# Altium schematic sheet PWM schematic.SchDoc
size A4; SheetNumber: 1; SheetTotal: 1; SPICEModelCacheMFJXASHD: <root> / <DocumentId>MFJXASHD</DocumentId> / <CacheFrame Number="0"> / <Model Name="xtal" Kind="CKT"> / <Text>*Generic type:crystal pkg:HC33/51 / .SUBCKT XTAL 1 2 PARAMS: FREQ=1Meg RS=750 C=13pf Q=1000 / LX 1 3 {((Q*RS)/(6.2831852*FREQ))} IC=0.5M / CX 3 4 {(1/(Q*6.2831852*FREQ*RS))} / C0 1 2 {C} / RS 4 2 {RS} / .ENDS XTAL</Text> / </Model> / <Model Name="4040" Kind="MDL"> / <Text>*12-bit Binary Counter - type:digital pkg:DIP16 [DVDD=16;DGND=8;](10,11,9,7,6,5,3,2,4,13,12,14,15,1) / .MODEL 4040 xsimcode(file="{MODEL_PATH}\Fairchild\4040.txt" func=4040 {mntymx})</Text> / </Model> / <Model Name="led1" Kind="MDL"> / <Text>*Typ RED GaAs LED: Vf=1.7V Vr=4V If=40mA trr=3uS / *LED Pinout: 1=A, 2=K / .MODEL LED1 D (IS=93.2P RS=42M N=3.73 BV=4 IBV=10U / + CJO=2.97P VJ=.75 M=.333 TT=4.32U)</Text> / </Model> / </CacheFrame> / </root>
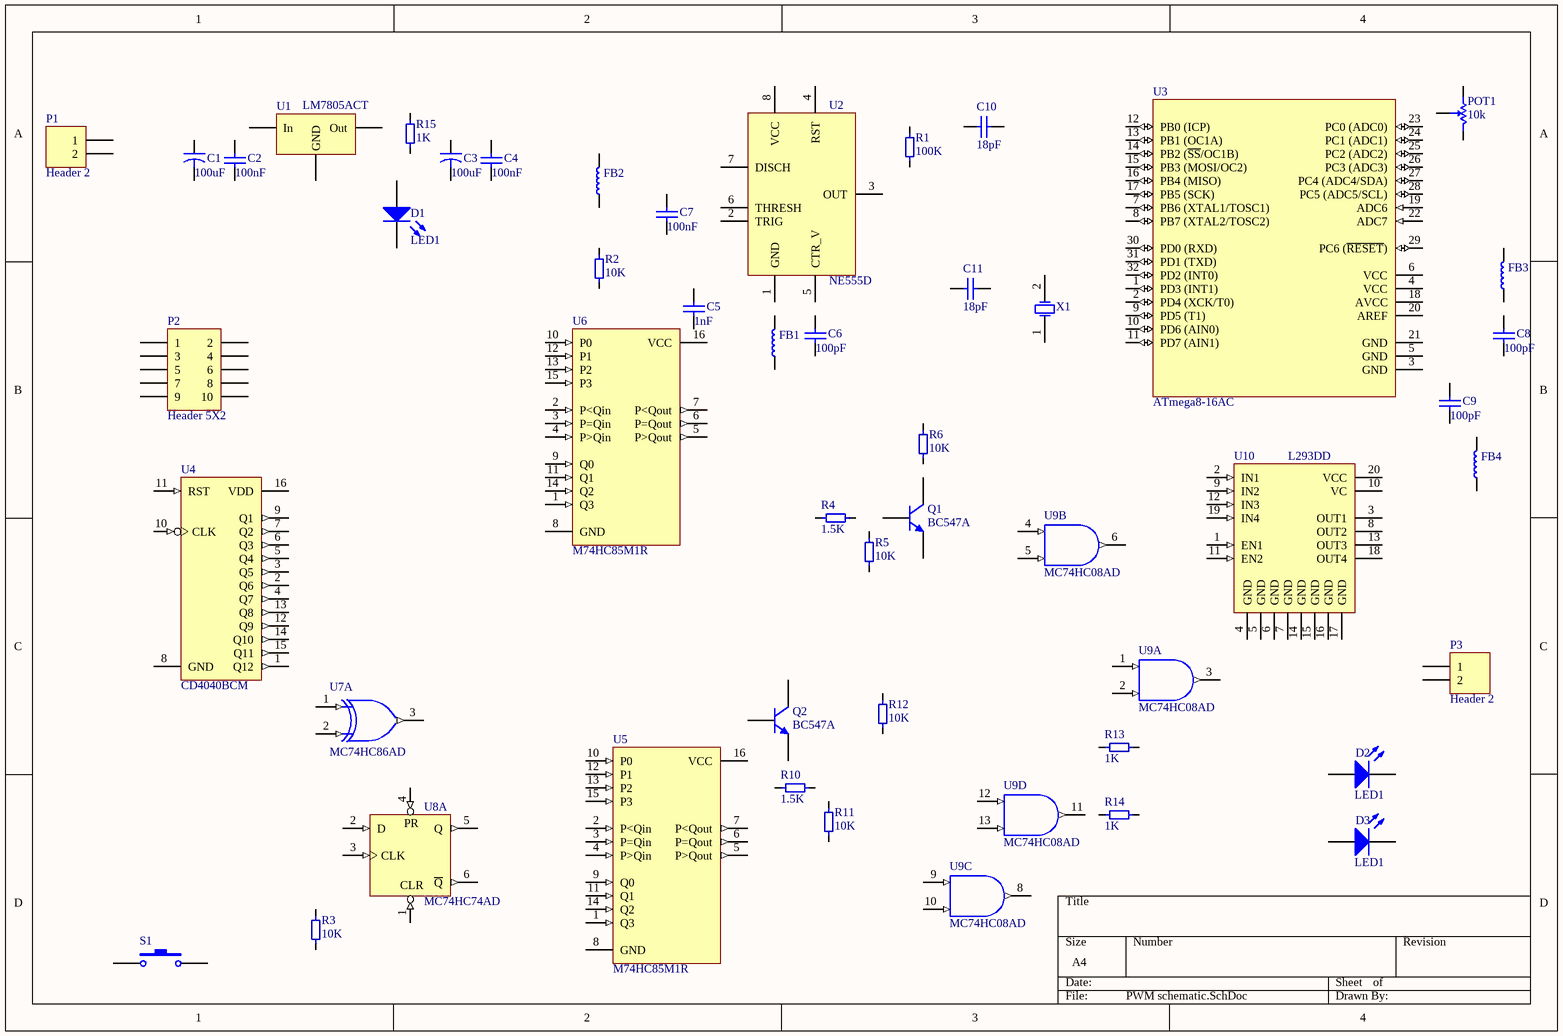
[diagram p0: PWM schematic.SchDoc]

## Parts
C1  value 100uF  [CAP_POL]  (hidden comment: Cap2)
C2  value 100nF  [SMD_805_CAP]  (hidden comment: Cap)
C3  value 100uF  [CAP_POL]  (hidden comment: Cap2)
C4  value 100nF  [SMD_805_CAP]  (hidden comment: Cap)
C5  value 1nF  [SMD_805_CAP]  (hidden comment: Cap)
C6  value 100pF  [SMD_805_CAP]  (hidden comment: Cap)
C7  value 100nF  [SMD_805_CAP]  (hidden comment: Cap)
C8  value 100pF  [SMD_805_CAP]  (hidden comment: Cap)
C9  value 100pF  [SMD_805_CAP]  (hidden comment: Cap)
C10  value 18pF  [SMD_805_CAP]  (hidden comment: Cap)
C11  value 18pF  [SMD_805_CAP]  (hidden comment: Cap)
D1  LED1  [SMD_1206_LED]
D2  LED1  [SMD_1206_LED]
D3  LED1  [SMD_1206_LED]
FB1  Ferrit Bead  [SMD_805_RES]  (value not drawn)
FB2  Ferrit Bead  [SMD_805_RES]  (value not drawn)
FB3  Ferrit Bead  [SMD_805_RES]  (value not drawn)
FB4  Ferrit Bead  [SMD_805_RES]  (value not drawn)
P1  Header 2  [ADAP_JACK2]
P2  Header 5X2  [BOX2x5_3D]
P3  Header 2  [PHOENIX_3]
POT1  10k  [Potentiometer]
Q1  BC547A  [2N3906 SOT23]
Q2  BC547A  [2N3906 SOT23]
R1  Resistor SMD  [SMD_805_RES]  (value not drawn)
R2  Resistor SMD  [SMD_805_RES]  (value not drawn)
R3  Resistor SMD  [SMD_805_RES]  (value not drawn)
R4  Resistor SMD  [SMD_805_RES]  (value not drawn)
R5  Resistor SMD  [SMD_805_RES]  (value not drawn)
R6  Resistor SMD  [SMD_805_RES]  (value not drawn)
R10  Resistor SMD  [SMD_805_RES]  (value not drawn)
R11  Resistor SMD  [SMD_805_RES]  (value not drawn)
R12  Resistor SMD  [SMD_805_RES]  (value not drawn)
R13  Resistor SMD  [SMD_805_RES]  (value not drawn)
R14  Resistor SMD  [SMD_805_RES]  (value not drawn)
R15  Resistor SMD  [SMD_805_RES]  (value not drawn)
S1  SW-PB  [PB_KEY]  (value not drawn)
U1  LM7805ACT  [TO220-3]
U2  NE555D  [SOIC-8]
U3  ATmega8-16AC  [32A_N]
U4  CD4040BCM  [M16A_N]
U5  M74HC85M1R  [SO16_N]
U6  M74HC85M1R  [SO16_N]
U7  MC74HC86AD  [751A-03_N]  (part A of 4)
U8  MC74HC74AD  [751A-03_N]  (part A of 2)
U9  MC74HC08AD  [751A-02_N]  (parts A,B,C,D of 4)
U10  L293DD  [SO20_N]
X1  XTAL  [Xtal]  (value not drawn)

## Nets
GND: U7.7(GND) U8.7(GND) U9.7(GND)
VDD: U7.14(VDD) U8.14(VDD) U9.14(VDD)

Not connected (* = marked no-connect by the designer): C1 1 2; C2 1 2; C3 1 2; C4 1 2; C5 1 2; C6 1 2; C7 1 2; C8 1 2; C9 1 2; C10 1 2; C11 1 2; D1 1(A) 2(K); D2 1(A) 2(K); D3 1(A) 2(K); FB1 1 2; FB2 1 2; FB3 1 2; FB4 1 2; P1 1 2; P2 1 2 3 4 5 6 7 8 9 10; P3 1 2; POT1 1(CCW) 2(CW) 3(SetPoint); Q1 1(C) 2(B) 3(E); Q2 1(C) 2(B) 3(E); R1 1 2; R2 1 2; R3 1 2; R4 1 2; R5 1 2; R6 1 2; R10 1 2; R11 1 2; R12 1 2; R13 1 2; R14 1 2; R15 1 2; S1 1 2; U1 1(In) 2(GND) 3(Out); U2 1(GND) 2(TRIG) 3(OUT) 4(RST) 5(CTR_V) 6(THRESH) 7(DISCH) 8(VCC); U3 1(PD3_(INT1)) 2(PD4_(XCK/T0)) 3(GND) 4(VCC) 5(GND) 6(VCC) 7(PB6_(XTAL1/TOSC1)) 8(PB7_(XTAL2/TOSC2)) 9(PD5_(T1)) 10(PD6_(AIN0)) 11(PD7_(AIN1)) 12(PB0_(ICP)) 13(PB1_(OC1A)) 14(PB2_(~{SS}/OC1B)) 15(PB3_(MOSI/OC2)) 16(PB4_(MISO)) 17(PB5_(SCK)) 18(AVCC) 19(ADC6) 20(AREF) 21(GND) 22(ADC7) 23(PC0_(ADC0)) 24(PC1_(ADC1)) 25(PC2_(ADC2)) 26(PC3_(ADC3)) 27(PC4_(ADC4/SDA)) 28(PC5_(ADC5/SCL)) 29(PC6_(~{RESET})) 30(PD0_(RXD)) 31(PD1_(TXD)) 32(PD2_(INT0)); U4 1(Q12) 2(Q6) 3(Q5) 4(Q7) 5(Q4) 6(Q3) 7(Q2) 8(GND) 9(Q1) 10(CLK) 11(RST) 12(Q9) 13(Q8) 14(Q10) 15(Q11) 16(VDD); U5 1(Q3) 2(P<Qin) 3(P=Qin) 4(P>Qin) 5(P>Qout) 6(P=Qout) 7(P<Qout) 8(GND) 9(Q0) 10(P0) 11(Q1) 12(P1) 13(P2) 14(Q2) 15(P3) 16(VCC); U6 1(Q3) 2(P<Qin) 3(P=Qin) 4(P>Qin) 5(P>Qout) 6(P=Qout) 7(P<Qout) 8(GND) 9(Q0) 10(P0) 11(Q1) 12(P1) 13(P2) 14(Q2) 15(P3) 16(VCC); U7 1(A) 2(B) 3(Y); U8 1(CLR) 2(D) 3(CLK) 4(PR) 5(Q) 6(~{Q}); U9 1(A) 2(B) 3(Y) 4(A) 5(B) 6(Y) 8(Y) 9(A) 10(B) 11(Y) 12(A) 13(B); U10 1(EN1) 2(IN1) 3(OUT1) 4(GND) 5(GND) 6(GND) 7(GND) 8(OUT2) 9(IN2) 10(VC) 11(EN2) 12(IN3) 13(OUT3) 14(GND) 15(GND) 16(GND) 17(GND) 18(OUT4) 19(IN4) 20(VCC); X1 1(OSC1) 2(OSC2)

## Notes on the sheet
- (in symbol Resistor SMD) 100K; 10K; 1.5K; 1K

## Library data of the parts
C1 C3 = Cap2: Capacitor; Published: 23-Sep-2002; PackageReference: CAPR5-4X5; Publisher: Altium Limited
C2 C4-C11 = Cap: Capacitor; Published: 8-Jun-2000; LatestRevisionDate: 17-Jul-2002; LatestRevisionNote: Re-released for DXP Platform.; PackageReference: RAD-0.3; Publisher: Altium Limited
D1-D3 = LED1: Typical RED GaAs LED; Published: 8-Jun-2000; LatestRevisionDate: 08-Jul-2005; LatestRevisionNote: Mech Layer 1 removed.; PackageReference: LED-1; Publisher: Altium Limited
P1 P3 = Header 2: Header, 2-Pin; LatestRevisionDate: 17-Jul-2002; LatestRevisionNote: Re-released for DXP Platform.; Publisher: Altium Limited
P2 = Header 5X2: Header, 5-Pin, Dual row; LatestRevisionDate: 17-Jul-2002; LatestRevisionNote: Re-released for DXP Platform.; Publisher: Altium Limited
POT1 = Potentiometer
Q1 Q2 = BC547A: Amplifier Transistor NPN Silicon; Published: 29-Sep-2000; LatestRevisionDate: 17-Jul-2002; LatestRevisionNote: Re-released for DXP Platform.; DatasheetVersion: 1991; PackageVersion: 1996; PackageReference: 29-04; Publisher: Altium Limited; PackageDescription: TO, Flat Index; 3 In-Line, Axial Leads; Body Dia. 4.8mm; Leads 0.48 x 0.5 mm (max); ComponentLink1Description: Manufacturer Link; ComponentLink1URL: http://www.onsemi.com/site/products/landing?taxonomyID=194; ComponentLink2Description: Datasheet; ComponentLink2URL: http://www.onsemi.com/pub/Collateral/BC546-D.PDF
S1 = SW-PB: Switch; Published: 24-Mar-1999; LatestRevisionDate: 17-Jul-2002; LatestRevisionNote: Re-released for DXP Platform.; PackageReference: SPST-2; Publisher: Altium Limited
U1 = LM7805ACT: IC REG LDO 5V 1A TO220-3; Manufacturer: Fairchild Semiconductor; Regulator Topology: Positive Fixed; Voltage - Dropout (Typical): 2V @ 1A; Number of Regulators: 1; Voltage - Input: Up to 35V; Supplier 1: Digi-Key; Manufacturer Part Number: LM7805ACT; RoHS: RoHS Compliant; Category: Integrated Circuits (ICs); Stock 1: 2136; Pricing 1: 1=0.57, 10=0.481, 25=0.4208, 100=0.3607, 250=0.31264, 500=0.26454, 1000=0.20442, 2500=0.18638, 5000=0.17436 (EUR); Packaging: Tube; Voltage - Output: 5V; Current - Output: 1A; Current - Limit (Min): -; Operating Temperature: 0°C ~ 125°C; Mounting Type: Through Hole; Package / Case: TO-220-3; Supplier Device Package: TO-220-3; ComponentLink1URL: http://www.fairchildsemi.com/datasheets/LM/LM7805.pdf; ComponentLink1Description: http://www.fairchildsemi.com/datasheets/LM/LM7805.pdf
U3 = ATmega8-16AC: 8-Bit AVR Microcontroller with 8K Bytes of In-System Programmable Flash Memory; Published: 17-Sep-2003; LatestRevisionDate: 13-Apr-2006; LatestRevisionNote: IPC-7351 Footprint Added.; DatasheetVersion: 2486H-AVR-09/02; PackageVersion: revB, Oct-2001; PackageReference: 32A; Publisher: Altium Limited; PackageDescription: 32-Pin Thin Quad Flat Pack 0.8 mm Pitch; Code_JEDEC: MS-026-ABA; ComponentLink1Description: Manufacturer Link; ComponentLink1URL: http://www.atmel.com; ComponentLink2Description: Datasheet; ComponentLink2URL: http://www.atmel.com/dyn/resources/prod_documents/doc2486.pdf
U4 = CD4040BCM: 12-Stage Ripple Carry Binary Counter; Published: 17-Jul-2002; LatestRevisionDate: 13-Apr-2006; LatestRevisionNote: IPC-7351 Footprint Added.; DatasheetVersion: Jan-1999; PackageVersion: 2000; PackageReference: M16A; Publisher: Altium Limited; PackageDescription: 16-Pin Small Outline Integrated Circuit 1.27 mm Pitch; Code_IPC: SOIC127P600-16; ComponentLink1Description: Manufacturer Link; ComponentLink1URL: http://www.fairchildsemi.com/; ComponentLink2Description: Datasheet; ComponentLink2URL: http://www.fairchildsemi.com/ds/CD%2FCD4040BC.pdf
U5 U6 = M74HC85M1R: 4-Bit Magnitude Comparator; Published: 8-Jun-2000; LatestRevisionDate: 13-Apr-2006; LatestRevisionNote: IPC-7351 Footprint Added.; DatasheetVersion: Dec-1992; PackageVersion: May-1998; PackageReference: SO16; Publisher: Altium Limited; PackageDescription: 16-Pin Small Outline Integrated Circuit 1.27 mm Pitch; Code_IPC: SOIC127P600-16; ComponentLink1Description: Manufacturer Link; ComponentLink1URL: http://www.st.com/; ComponentLink2Description: Datasheet; ComponentLink2URL: http://www.st.com/stonline/products/literature/ds/2005/m74hc85.pdf
U7 = MC74HC86AD: Quad 2-Input XOR Gate; Published: 15-Apr-2002; LatestRevisionDate: 13-Apr-2006; LatestRevisionNote: IPC-7351 Footprint Added.; DatasheetVersion: Mar-2000; PackageReference: 751A-03; Publisher: Altium Limited; PackageDescription: 14-Pin Small Outline Integrated Circuit 1.27 mm Pitch; Code_JEDEC: MS-012-AB; Code_IPC: SOIC127P600-14; ComponentLink1Description: Manufacturer Link; ComponentLink1URL: http://www.onsemi.com/; ComponentLink2Description: Datasheet; ComponentLink2URL: http://www.onsemi.com/pub/Collateral/MC74HC86A-D.PDF
U8 = MC74HC74AD: Dual D-Type Flip-Flop with Set and Reset; Published: 15-Apr-2002; LatestRevisionDate: 13-Apr-2006; LatestRevisionNote: IPC-7351 Footprint Added.; DatasheetVersion: Mar-2000; PackageReference: 751A-03; Publisher: Altium Limited; PackageDescription: 14-Pin Small Outline Integrated Circuit 1.27 mm Pitch; Code_JEDEC: MS-012-AB; Code_IPC: SOIC127P600-14; ComponentLink1Description: Manufacturer Link; ComponentLink1URL: http://www.onsemi.com/; ComponentLink2Description: Datasheet; ComponentLink2URL: http://www.onsemi.com/pub/Collateral/MC74HC74A-D.PDF
U9 = MC74HC08AD: Quad 2-Input AND Gate; Published: 17-Jul-2002; LatestRevisionDate: 13-Apr-2006; LatestRevisionNote: IPC-7351 Footprint Added.; DatasheetVersion: 1989; PackageVersion: 1991; PackageReference: 751A-02; Publisher: Altium Limited; PackageDescription: 14-Pin Small Outline Integrated Circuit 1.27 mm Pitch; Code_IPC: SOIC127P600-14; ComponentLink1Description: Manufacturer Link; ComponentLink1URL: http://www.onsemi.com/site/products/parametrics/0,4446,247,00.html; ComponentLink2Description: Ibis Model; ComponentLink2URL: http://www.onsemi.com/pub/Collateral/MC54HC08AJ.IBS
U10 = L293DD: Push-Pull Four Channel Driver With Diode; Published: 8-Jun-2000; LatestRevisionDate: 13-Apr-2006; LatestRevisionNote: IPC-7351 Footprint Added.; DatasheetVersion: Jun-1996; PackageVersion: Jul-2001; PackageReference: SO20; Publisher: Altium Limited; PackageDescription: 20-Pin Plastic Small Outline Integrated Circuit 1.27 mm Pitch; Code_JEDEC: MS-013-AC; Code_IPC: SOIC127P1030-20; ComponentLink1Description: Manufacturer Link; ComponentLink1URL: http://www.st.com/; ComponentLink2Description: Datasheet; ComponentLink2URL: http://www.st.com/stonline/products/literature/ds/1330/l293d.pdf
X1 = XTAL: Crystal Oscillator; Published: 8-Jun-2000; LatestRevisionDate: 17-Jul-2002; LatestRevisionNote: Re-released for DXP Platform.; PackageReference: R38; Publisher: Altium Limited